# EasyEDA Pro project Modem Carrier.eprj

# Schematic Schematic1
Board Name: Board1; Create Date: 2025-12-26; Page Name: P1; Project Name: Modem Carrier; Schematic Name: Schematic1; Update Date: 2025-12-26; Company: EasyEDA.com; Page Size: A4; Version: V1.0
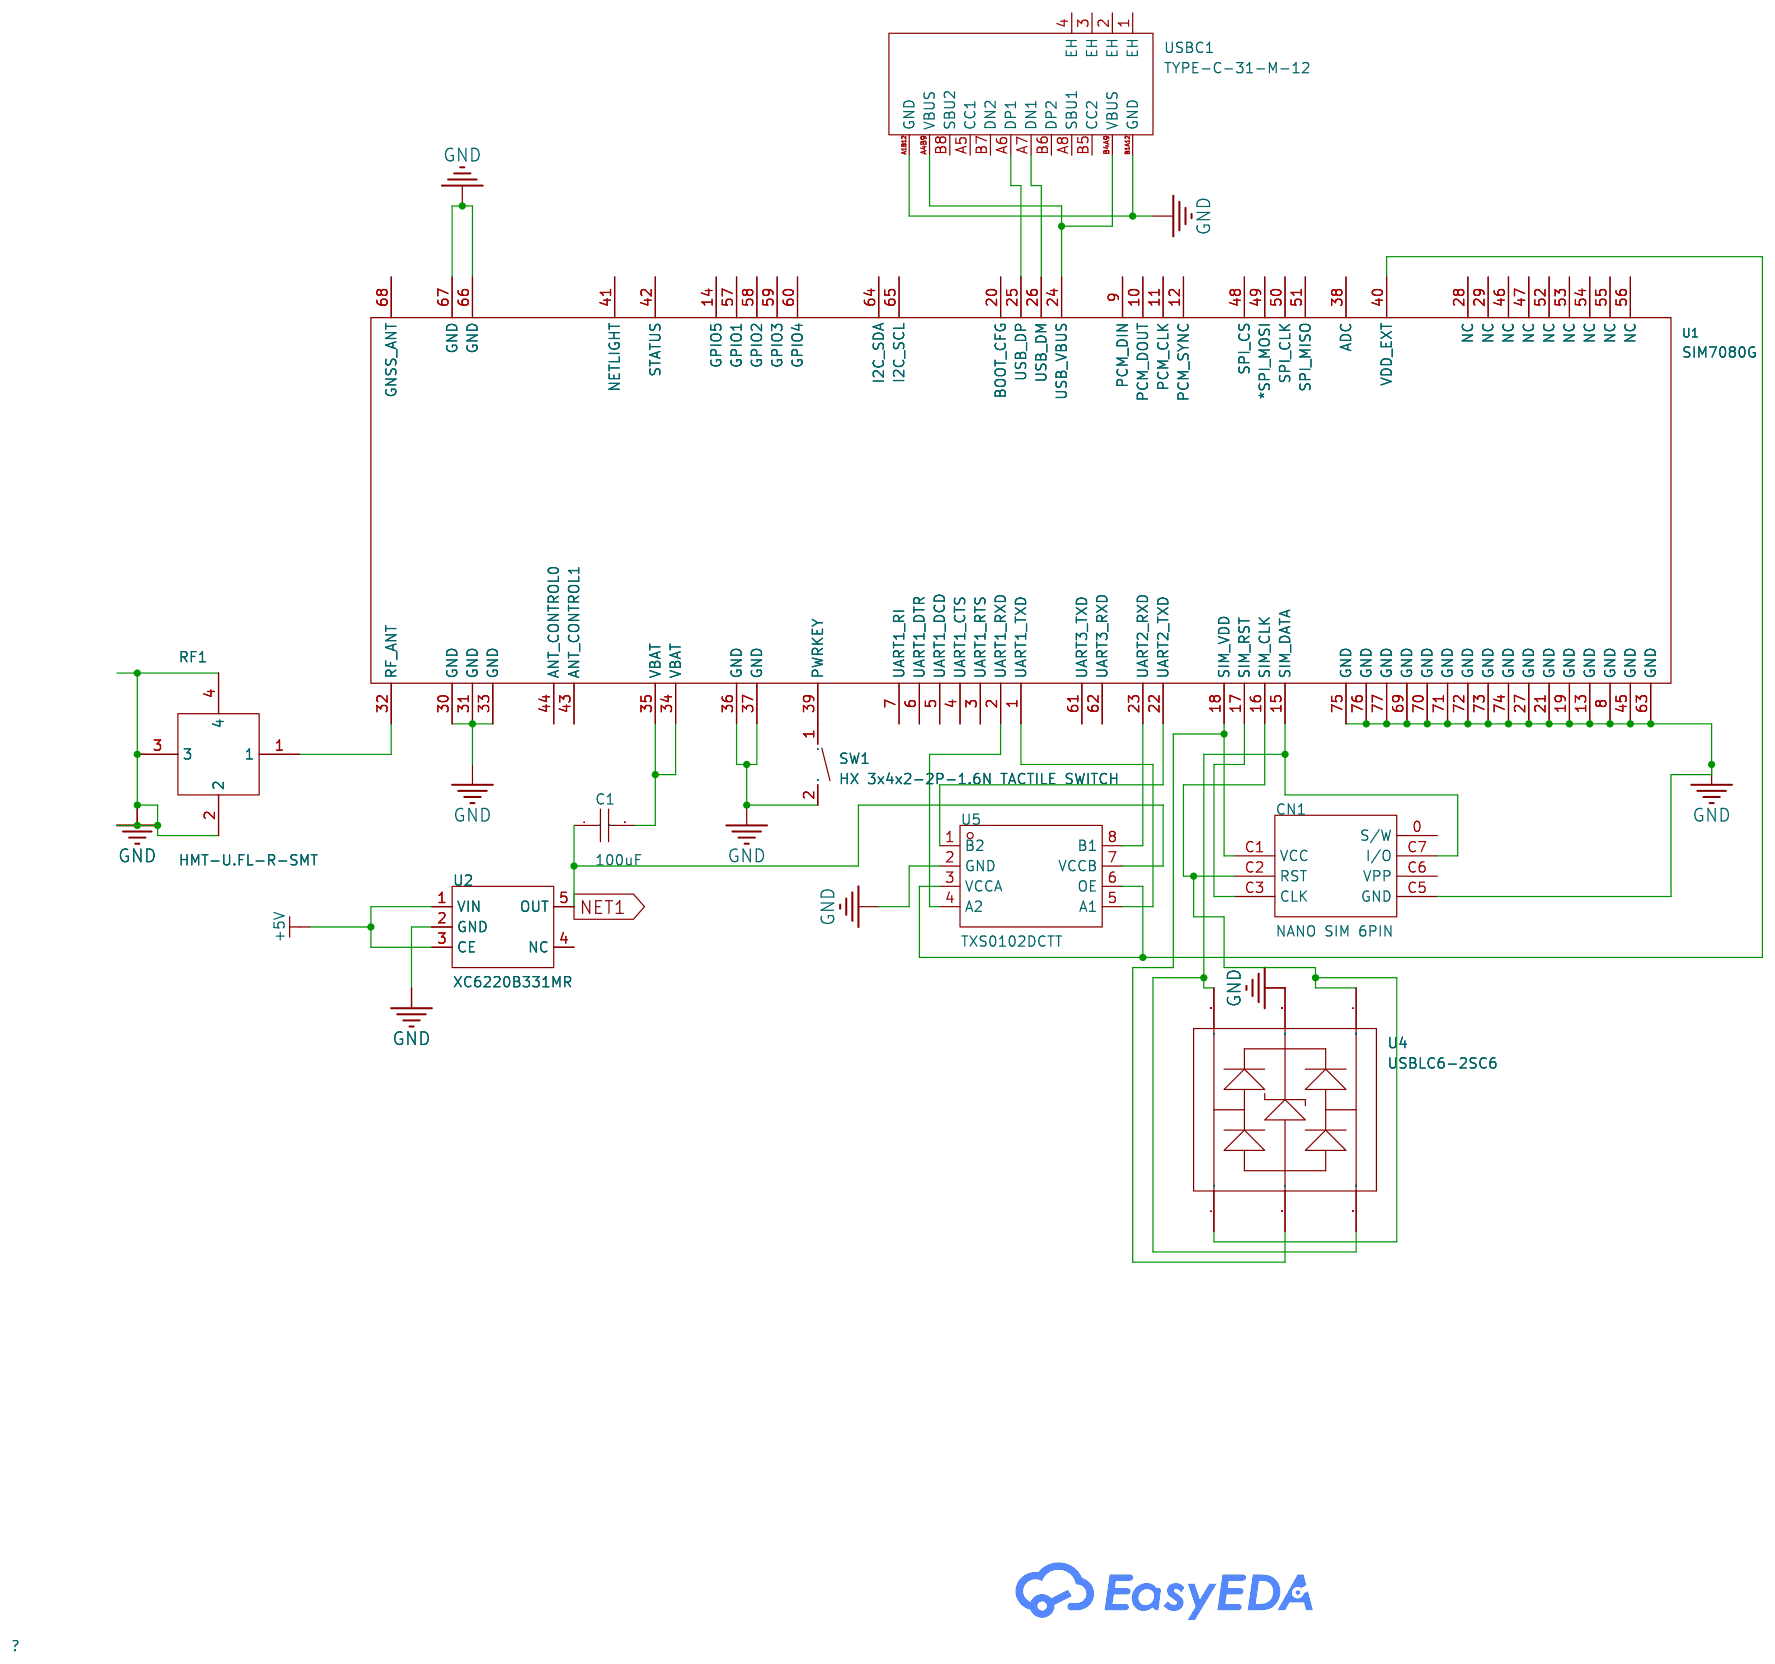
[diagram p0: schematic sheet]

## Parts
C1  100uF  [C1206]
CN1  NANO SIM 6PIN  [SIM-SMD_C77877]
RF1  HMT-U.FL-R-SMT  [IPEX-SMD_4P-L2.6-W2.6-LS3.1]
SW1  HX 3x4x2-2P-1.6N TACTILE SWITCH  [KEY-SMD_L4.0-W3.0-LS4.9-1]
U1  SIM7080G  [LCC-SMD_SIM7080G]
U2  XC6220B331MR  [SOT-23-5_L2.9-W1.6-P0.95-LS2.8-BR]
U4  USBLC6-2SC6  [SOT-23-6_L2.9-W1.6-P0.95-LS2.8-BL]
U5  TXS0102DCTT  [SSOP-8_L3.0-W2.8-P0.65-LS4.0-BL]
USBC1  TYPE-C-31-M-12  [USB-C_SMD-TYPE-C-31-M-12_1]

## Library data of the parts
C1 = CL31A107MQHNNNE: LCSC Part Name: 100uF ±20% 6.3V; Supplier Part: C15008; Manufacturer: SAMSUNG(三星); Supplier Footprint: 1206; JLCPCB Part Class: Basic Part; Datasheet: https://item.szlcsc.com/datasheet/CL31A107MQHNNNE/15681.html; Supplier: LCSC; Tolerance: ±20%; Voltage Rating: 6.3V; Temperature Coefficient: X5R
CN1 = NANO SIM 6PIN: LCSC Part Name: 翻盖式 NanoSIM卡 卡座; Supplier Part: C77877; Manufacturer: BOOMELE(博穆精密); Supplier Footprint: SMD; JLCPCB Part Class: Extended Part; Datasheet: https://item.szlcsc.com/datasheet/NANO%2520SIM%25206PIN/79011.html; Supplier: LCSC; Card Connection Mode: Hinged Lid; Card Type: Nano-SIM Card; Connector Type: Connector and Ejector; Height Above Board: 1.4mm; Operating Temperature: -30℃~+80℃
RF1 = HMT-U.FL-R-SMT: LCSC Part Name: 天线座 射频连接座 一代座子 天线连接座 镀金 内针; Supplier Part: C53122033; Manufacturer: HMTCONN(华明通); Supplier Footprint: SMD; JLCPCB Part Class: Extended Part; Datasheet: https://item.szlcsc.com/datasheet/HMT-U.FL-R-SMT/56105344.html; Supplier: LCSC
SW1 = HX 3x4x2-2P-1.6N TACTILE SWITCH: LCSC Part Name: 4*3*2mm 立贴 轻触开关; Supplier Part: C49234124; Manufacturer: hanxia(韩下); Supplier Footprint: SMD; JLCPCB Part Class: Extended Part; Datasheet: https://item.szlcsc.com/datasheet/HX%25203x4x2-2P-1.6N%2520TACTILE%2520SWITCH/51650185.html; Supplier: LCSC; Circuit: SPST; Actuator Style: Round Button; Operating Force: 1.6N; Mounting Type: Surface Mount,Vertical; Length: 4mm; Width: 3mm; Switch Height: 2mm; with Bracket: Without Bracket; Contact Current: 50mA; Voltage Rating: 12V; Actuator/Cap Color: Black; With Lamp: No; Termination Style: SMD(SMT) Tab; Life: 100,000 Cycles
U1 = SIM7080G: LCSC Part Name: 多频段CAT-M和NB-IoT模块; Supplier Part: C2943992; Manufacturer: SIMCOM(芯讯通无线科技); Supplier Footprint: SMD,15.7x17.6mm; JLCPCB Part Class: Extended Part; Datasheet: https://item.szlcsc.com/datasheet/SIM7080G/3329189.html; Supplier: LCSC
U2 = XC6220B331MR: LCSC Part Name: 900mA,25uA,高PSRR电压调节器; Supplier Part: C3040644; Manufacturer: TECH PUBLIC(台舟); Supplier Footprint: SOT-23-5; JLCPCB Part Class: Extended Part; Datasheet: https://item.szlcsc.com/datasheet/XC6220B331MR/3597969.html; Supplier: LCSC; Output Type: Fixed; Voltage - Supply: 5.5V; Output Voltage: 3.3V; Output Current: 900mA; Power Supply Rejection Ratio (PSRR): 50dB@(10kHz); Voltage Dropout: 400mV@(800mA); standby current: 25uA; Features: Over Current Protection；Over Temperature Protection; Operating Temperature: -40℃~+85℃@(Ta); Output Configuration: Positive; Number of Outputs: 1
U4 = USBLC6-2SC6_C6807798: LCSC Part Name: 单向ESD 5V截止 峰值脉冲电流：8A; Supplier Part: C6807798; Manufacturer: FUXINSEMI(富芯森美); Supplier Footprint: SOT-23-6L; JLCPCB Part Class: Extended Part; Datasheet: https://item.szlcsc.com/datasheet/USBLC6-2SC6/7769286.html; Supplier: LCSC; Polarity: Unidirectional; Reverse Stand-Off Voltage (Vrwm): 5V; Clamping Voltage: 10.4V; Peak Pulse Current (Ipp): 8A; Peak Pulse Power Dissipation (Ppp): 120W; Voltage - Breakdown: 9V; Reverse Leakage Current (Ir): 10nA; Number of Channels: three routes; Operating Temperature: -55℃~+125℃; level of protection: IEC 61000-4-2; Type: ESD; Junction Capacitance: 0.35pF；6pF；0.7pF
U5 = TXS0102DCTT: LCSC Part Name: 24Mbps 2位双向电平转换器; Supplier Part: C2677354; Manufacturer: TI(德州仪器); Supplier Footprint: SSOP-8; JLCPCB Part Class: Extended Part; Datasheet: https://www.ti.com/cn/lit/gpn/txs0102; Supplier: LCSC; Channel Type: Bidirectional; Data Rate: 24Mbps; Voltage - Supply(VCCA): 1.65V~3.6V; Voltage - Supply(VCCB): 2.3V~5.5V; Number of Elements: 1; Number of Circuits: 2; Output Type: Open Drain；Push-Pull; Operating Temperature: -40℃~+85℃; Features: Auto Direction Detection
USBC1 = TYPE-C-31-M-12: LCSC Part Name: Type-C 母 卧贴; Supplier Part: C165948; Manufacturer: 韩国韩荣; Supplier Footprint: SMD; JLCPCB Part Class: Extended Part; Datasheet: https://item.szlcsc.com/datasheet/TYPE-C-31-M-12/177331.html; Supplier: LCSC; Connector Type: Type-C; Gender: Female; Mounting Type: Surface Mount, Right Angle; Number of Contacts: 16P; Number of Ports: 1; Current Rating-Power: 5A; Voltage Rating: 20V; Connect-Disconnect Life: 10,000 cycles; Length: 7.35mm; Operating Temperature: -30℃~+80℃

## Nets
+5V: U2.1(VIN) U2.3(CE)
GND: CN1.C5(GND) RF1.2 RF1.3 RF1.4 SW1.2 U1.8(GND) U1.13(GND) U1.19(GND) U1.21(GND) U1.27(GND) U1.30(GND) U1.31(GND) U1.33(GND) U1.36(GND) U1.37(GND) U1.45(GND) U1.63(GND) U1.66(GND) U1.67(GND) U1.69(GND) U1.70(GND) U1.71(GND) U1.72(GND) U1.73(GND) U1.74(GND) U1.75(GND) U1.76(GND) U1.77(GND) U2.2(GND) U4.5(VCC) U5.2(GND) USBC1.A1B12(GND) USBC1.B1A12(GND)
NET1: C1.1 U2.5(OUT) U5.7(VCCB)
$1N1629: SW1.1 U1.39(PWRKEY)
$1N1670: CN1.C3(CLK) U1.17(SIM_RST)
$1N2102: U1.24(USB_VBUS) USBC1.A4B9(VBUS) USBC1.B4A9(VBUS)
$1N2108: U1.25(USB_DP) USBC1.A6(DP1)
$1N2114: U1.26(USB_DM) USBC1.A7(DN1)
$1N2436: RF1.1 U1.32(RF_ANT)
$1N2512: C1.2 U1.34(VBAT) U1.35(VBAT)
$1N2630: U1.40(VDD_EXT) U5.3(VCCA) U5.6(OE)
$1N2669: U1.1(UART1_TXD) U5.5(A1)
$1N2679: U1.2(UART1_RXD) U5.4(A2)
$1N2693: U1.23(UART2_RXD) U5.8(B1)
$1N2936: CN1.C7(I/O) U1.15(SIM_DATA) U4.3(I/O2) U4.6(I/O1)
$1N3075: U1.22(UART2_TXD) U5.1(B2)
$1N3176: CN1.C1(VCC) U1.18(SIM_VDD) U4.2(GND)
$1N3194: CN1.C2(RST) U1.16(SIM_CLK) U4.1(I/O1) U4.4(I/O2)

Not connected (* = marked no-connect by the designer): CN1 0(S/W) C6(VPP); U1 3(UART1_RTS) 4(UART1_CTS) 5(UART1_DCD) 6(UART1_DTR) 7(UART1_RI) 9(PCM_DIN) 10(PCM_DOUT) 11(PCM_CLK) 12(PCM_SYNC) 14(GPIO5) 20(BOOT_CFG) 28(NC) 29(NC) 38(ADC) 41(NETLIGHT) 42(STATUS) 43(ANT_CONTROL1) 44(ANT_CONTROL0) 46(NC) 47(NC) 48(SPI_CS) 49(*SPI_MOSI) 50(SPI_CLK) 51(SPI_MISO) 52(NC) 53(NC) 54(NC) 55(NC) 56(NC) 57(GPIO1) 58(GPIO2) 59(GPIO3) 60(GPIO4) 61(UART3_TXD) 62(UART3_RXD) 64(I2C_SDA) 65(I2C_SCL) 68(GNSS_ANT); U2 4(NC); USBC1 1(EH) 2(EH) 3(EH) 4(EH) A5(CC1) A8(SBU1) B5(CC2) B6(DP2) B7(DN2) B8(SBU2)

# Board PCB1
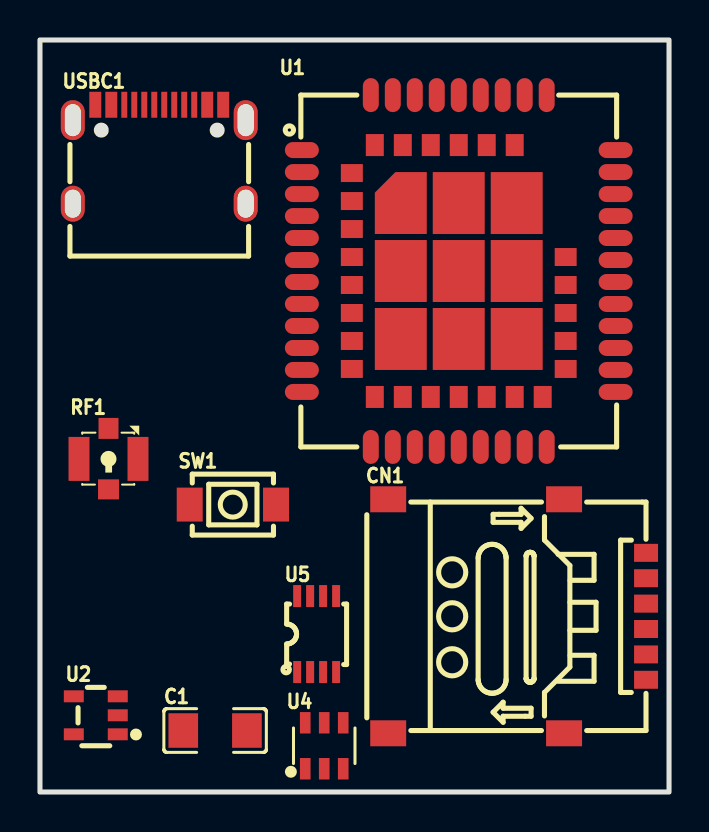
[diagram p1: board, top side]
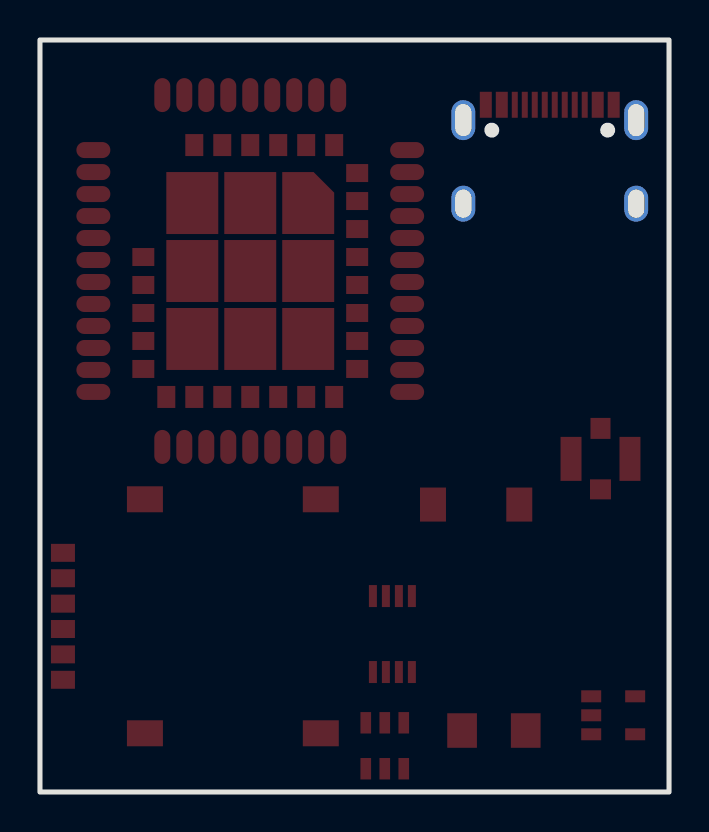
[diagram p2: board, bottom side, seen from below]

Outline 31.48 x 37.62 mm; copper layers: Top Layer, Bottom Layer. Coordinates in mm from the lower left corner of the outline.
Outline path: rectangle 0,37.62 31.48,0
Stack: Top Layer 0.035mm / Dielectric1 1.51mm FR4 er 4.5 / Bottom Layer 0.035mm

## Design rules (mm)
template: JLCPCB Capability(Two Layers Board)
spacing copperThickness1oz (default): track to track 0.102, other pairs 0.152 to 0.3
spacing copperThickness2oz: track to track 0.203, other pairs 0.152 to 0.3
track width copperThickness1oz (default): min 0.127, default 0.254, max 2.54
track width copperThickness2oz: min 0.203, default 0.254, max 2.54
differential pair differentialPair (default): width min 0.127, default 0.254, max 2.54; gap min 0.152, default 0.152
via viaSize (default): diameter min 0.5, default 0.61, max 10; hole min 0.3, default 0.305, max 6.3

## Placement (name value [footprint] x y rotation side)
C1  100uF  [C1206]  8.76 3.08 0 top
CN1  NANO SIM 6PIN  [SIM-SMD_C77877]  23.88 8.79 0 top
RF1  HMT-U.FL-R-SMT  [IPEX-SMD_4P-L2.6-W2.6-LS3.1]  3.43 16.67 0 top
SW1  HX 3x4x2-2P-1.6N TACTILE SWITCH  [KEY-SMD_L4.0-W3.0-LS4.9-1]  9.65 14.38 0 top
U1  SIM7080G  [LCC-SMD_SIM7080G]  20.95 26.06 0 top
U2  XC6220B331MR  [SOT-23-5_L2.9-W1.6-P0.95-LS2.8-BR]  2.79 3.84 0 top
U4  USBLC6-2SC6  [SOT-23-6_L2.9-W1.6-P0.95-LS2.8-BL]  14.22 2.31 0 top
U5  TXS0102DCTT  [SSOP-8_L3.0-W2.8-P0.65-LS4.0-BL]  13.84 7.9 0 top
USBC1  TYPE-C-31-M-12  [USB-C_SMD-TYPE-C-31-M-12_1]  5.97 31.91 0 top

## Footprints (pads in the part's own frame, mm; a bottom-side part is the same pattern mirrored in y, then rotated)
C1206
  rect 1.485x1.728 smd: 1(-1.593,0) 2(1.593,0)
IPEX-SMD_4P-L2.6-W2.6-LS3.1
  rect 1.05x2.2 smd: 1(-1.475,0) 3(1.475,0)
  rect 1x1.05 smd: 2(0,1.525)
  rect 1.05x1 smd: 4(0.001,-1.525)
KEY-SMD_L4.0-W3.0-LS4.9-1
  rect 1.3x1.7 smd: 1(-2.159,0) 2(2.159,0)
LCC-SMD_SIM7080G
  oval 1.7x0.8 smd: 1(-7.85,6.05) 2(-7.85,4.95) 3(-7.85,3.85) 4(-7.85,2.75) 5(-7.85,1.65) 6(-7.85,0.55) 7(-7.85,-0.55) 8(-7.85,-1.65) 9(-7.85,-2.75) 10(-7.85,-3.85) 11(-7.85,-4.95) 12(-7.85,-6.05) 22(7.85,-6.05) 23(7.85,-4.95) 24(7.85,-3.85) 25(7.85,-2.75) 26(7.85,-1.65) 27(7.85,-0.55) 28(7.85,0.55) 29(7.85,1.65) 30(7.85,2.75) 31(7.85,3.85) 32(7.85,4.95) 33(7.85,6.05)
  oval 0.8x1.7 smd: 13(-4.4,-8.8) 14(-3.3,-8.8) 15(-2.2,-8.8) 16(-1.1,-8.8) 17(0,-8.8) 18(1.1,-8.8) 19(2.2,-8.8) 20(3.3,-8.8) 21(4.4,-8.8) 34(4.4,8.8) 35(3.3,8.8) 36(2.2,8.8) 37(1.1,8.8) 38(0,8.8) 39(-1.1,8.8) 40(-2.2,8.8) 41(-3.3,8.8) 42(-4.4,8.8)
  rect 1.1x0.9 smd: 43(-5.35,4.9) 44(-5.35,3.5) 45(-5.35,2.1) 46(-5.35,0.7) 47(-5.35,-0.7) 48(-5.35,-2.1) 49(-5.35,-3.5) 50(-5.35,-4.9) 58(5.35,-4.9) 59(5.35,-3.5) 60(5.35,-2.1) 61(5.35,-0.7) 62(5.35,0.7)
  rect 0.9x1.1 smd: 51(-4.2,-6.3) 52(-2.8,-6.3) 53(-1.4,-6.3) 54(0,-6.3) 55(1.4,-6.3) 56(2.8,-6.3) 57(4.2,-6.3) 63(2.8,6.3) 64(1.4,6.3) 65(0,6.3) 66(-1.4,6.3) 67(-2.8,6.3) 68(-4.2,6.3)
  custom 2.6x3.1 smd: 69(-2.9,3.4)
  rect 2.6x3.1 smd: 70(-2.9,0) 71(-2.9,-3.4) 72(0,-3.4) 73(2.9,-3.4) 74(2.9,0) 75(2.9,3.4) 76(0,3.4) 77(0,0)
SIM-SMD_C77877
  rect 1.8x1.3 smd: 0(-6.451,5.853) 0(-6.451,-5.853) 0(2.349,5.853) 0(2.349,-5.853)
  rect 1.2x0.9 smd: C1(6.451,3.174) C2(6.451,0.633) C3(6.451,-1.907) C5(6.451,1.903) C6(6.451,-0.636) C7(6.451,-3.176)
SOT-23-5_L2.9-W1.6-P0.95-LS2.8-BR
  rect 1x0.6 smd: 1(1.1,-0.95) 2(1.1,0) 3(1.1,0.95) 4(-1.1,0.95) 5(-1.1,-0.95)
SOT-23-6_L2.9-W1.6-P0.95-LS2.8-BL
  rect 0.532x1.072 smd: 1(-0.95,-1.149) 2(0,-1.149) 3(0.95,-1.149) 4(0.95,1.149) 5(0,1.149) 6(-0.95,1.149)
SSOP-8_L3.0-W2.8-P0.65-LS4.0-BL
  rect 0.4x1.1 smd: 1(-0.975,-1.9) 2(-0.325,-1.9) 3(0.325,-1.9) 4(0.975,-1.9) 5(0.975,1.9) 6(0.325,1.9) 7(-0.325,1.9) 8(-0.975,1.9)
USB-C_SMD-TYPE-C-31-M-12_1
  oval 1.2x2 hole 0.8x1.6: 1(4.325,1.706) 4(-4.325,1.706)
  oval 1.2x1.8 hole 0.8x1.4: 2(4.325,-2.474) 3(-4.325,-2.474)
  custom 0.6x1.3 smd: A1B12(-3.2,2.474) A4B9(-2.4,2.474) B1A12(3.2,2.474) B4A9(2.401,2.474)
  rect 0.3x1.3 smd: A5(-1.25,2.474) A6(-0.25,2.474) A7(0.25,2.474) A8(1.25,2.474) B5(1.75,2.474) B6(0.75,2.474) B7(-0.75,2.474) B8(-1.75,2.474)

## Nets
As in the schematic.

Pads without a net: CN1 0 C6; U1 3 4 5 6 7 9 10 11 12 14 20 28 29 38 41 42 43 44 46 47 48 49 50 51 52 53 54 55 56 57 58 59 60 61 62 64 65 68; U2 4; USBC1 1 2 3 4 A5 A8 B5 B6 B7 B8
